# EasyEDA Pro project G-CU_2023-09-08_13-42-00.eprj, board PCB1
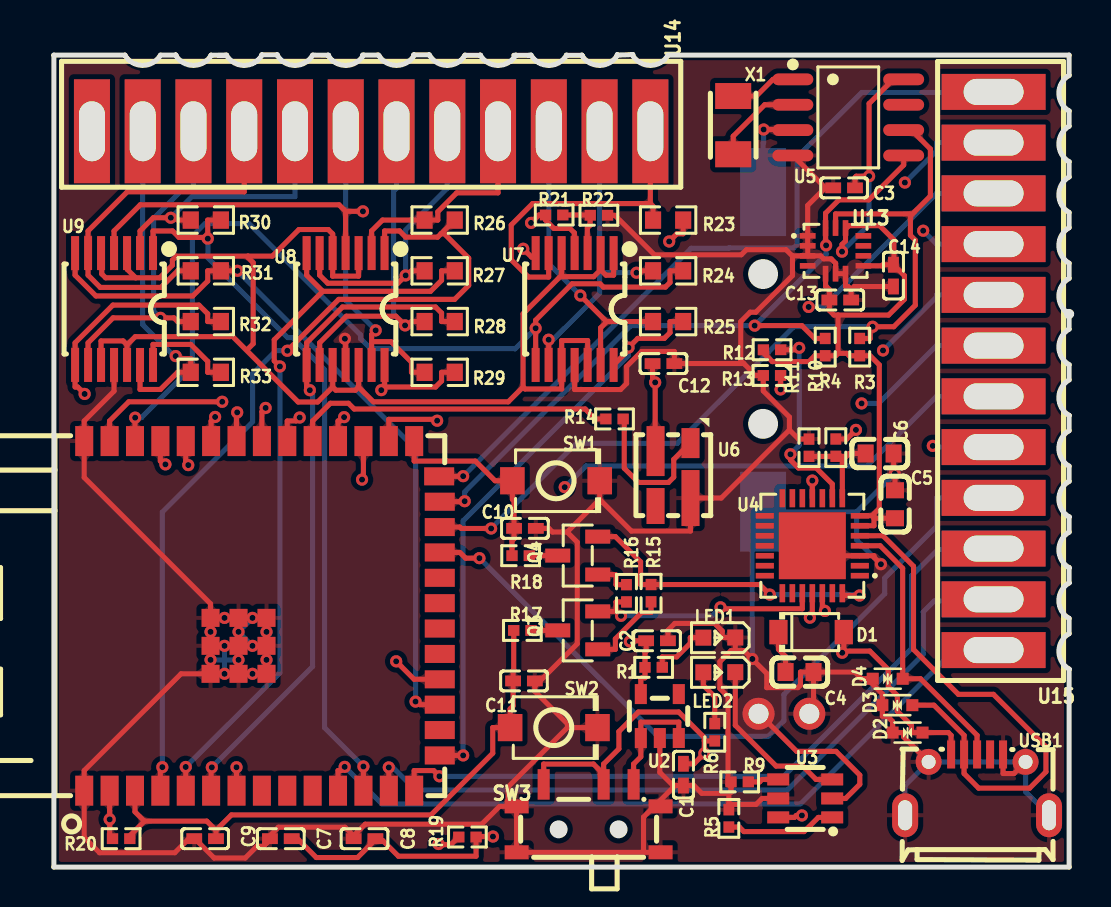
[diagram p2: board, top side]
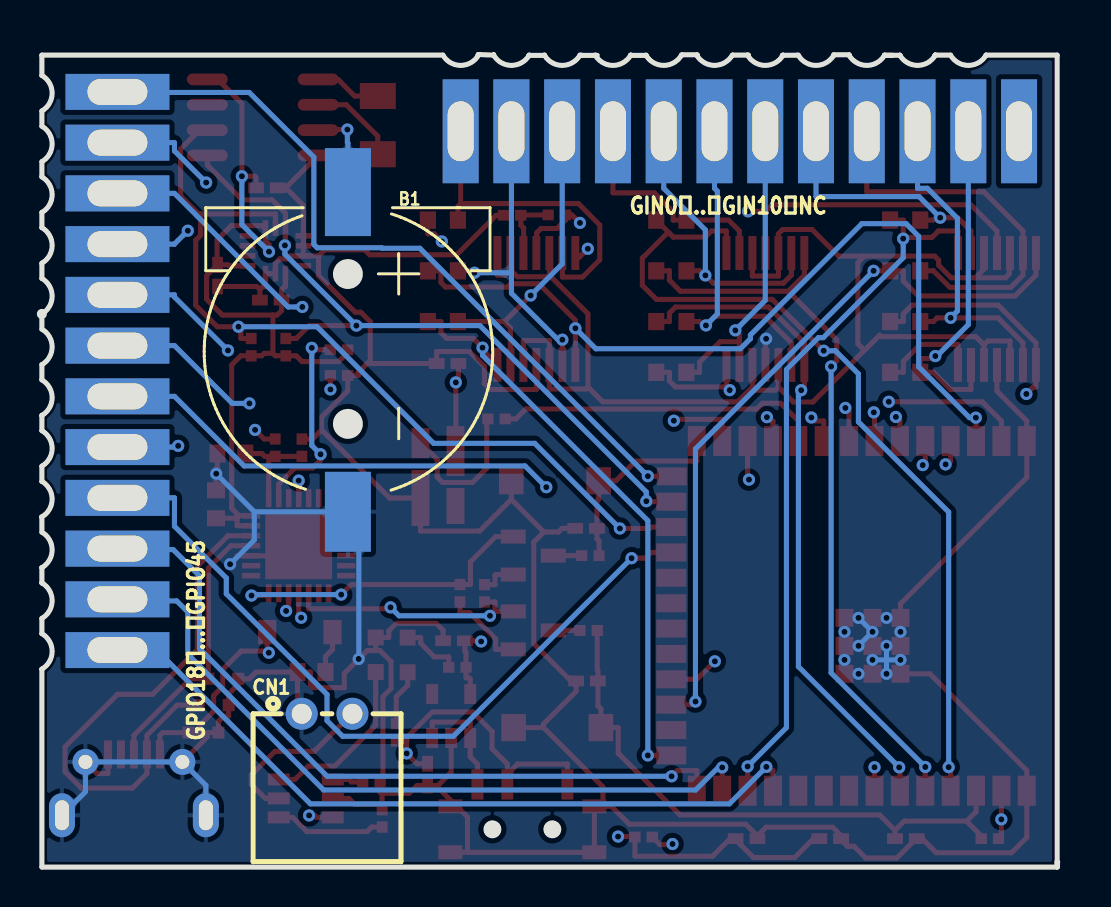
[diagram p3: board, bottom side, seen from below]

Outline 50.8 x 40.67 mm; copper layers: Top Layer, 信号层1, 信号层2, Bottom Layer. Coordinates in mm from the lower left corner of the outline.
Outline path: 3.56,40.64 0,40.64 0,0 50.8,0 50.8,9.91 arc(50.29,10.8) 50.8,11.68 50.8,12.45 arc(50.29,13.33) 50.8,14.22 50.8,14.99 arc(50.29,15.87) 50.8,16.76 50.8,17.53 arc(50.29,18.42) 50.8,19.3 50.8,20.07 arc(50.29,20.95) 50.8,21.84 50.8,22.61 arc(50.29,23.49) 50.8,24.38 50.8,25.15 arc(50.29,26.03) 50.8,26.92 50.8,27.69 arc(50.29,28.58) 50.8,29.46 50.8,30.23 arc(50.29,31.11) 50.8,32 50.8,32.77 arc(50.29,33.66) 50.8,34.54 50.8,35.31 arc(50.29,36.19) 50.8,37.08 50.8,37.85 arc(50.29,38.73) 50.8,39.62 50.8,40.64 30.73,40.64 arc(29.84,40.13) 28.96,40.64 ; 3.56,40.64 3.55,40.64 ; 3.56,40.64 arc(4.45,40.13) 5.33,40.64 6.1,40.64 6.1,40.64 6.11,40.63 ; 6.1,40.64 arc(6.1,40.64) 6.1,40.64 arc(6.98,40.13) 7.87,40.63 ; 7.86,40.63 7.87,40.63 ; 7.87,40.63 arc(7.87,40.64) 7.87,40.64 ; 7.87,40.63 8.64,40.64 arc(8.64,40.64) 8.64,40.63 ; 8.25,40.63 8.64,40.63 ; 8.64,40.63 arc(9.53,40.13) 10.41,40.64 10.4,40.66 ; 10.41,40.66 11.17,40.66 11.18,40.64 arc(12.06,40.13) 12.95,40.64 13.72,40.63 ; 13.72,40.63 arc(13.72,40.64) 13.72,40.64 ; 13.72,40.63 13.74,40.63 13.75,40.62 ; 13.72,40.63 arc(13.72,40.63) 13.73,40.62 arc(14.62,40.13) 15.49,40.64 16.21,40.64 16.22,40.64 ; 15.44,40.64 15.49,40.64 ; 18,40.66 18.03,40.64 arc(17.15,40.13) 16.26,40.64 ; 18.03,40.66 18.77,40.66 18.8,40.64 arc(19.68,40.13) 20.57,40.63 ; 20.57,40.63 21.33,40.63 21.34,40.63 ; 20.57,40.63 arc(20.57,40.64) 20.57,40.64 ; 21.34,40.63 arc(21.34,40.63) 21.34,40.64 arc(21.34,40.64) 21.34,40.64 ; 21.34,40.63 arc(22.23,40.13) 23.11,40.63 ; 23.01,40.63 23.11,40.63 ; 23.11,40.63 23.78,40.63 23.88,40.64 arc(24.76,40.13) 25.65,40.63 ; 23.11,40.63 arc(23.11,40.64) 23.11,40.64 ; 25.65,40.63 26.42,40.63 26.43,40.62 ; 25.65,40.63 arc(25.65,40.64) 25.65,40.64 ; 26.43,40.62 arc(26.42,40.63) 26.42,40.63 arc(26.42,40.64) 26.42,40.64 ; 26.43,40.62 arc(27.31,40.13) 28.19,40.64 28.96,40.67 28.96,40.67 28.97,40.66
Stack: Top Layer 0.035mm / Dielectric1 0.48mm PP er 4.5 / 信号层1 0.035mm / Dielectric2 0.48mm FR4 er 4.5 / 信号层2 0.035mm / Dielectric3 0.48mm PP er 4.5 / Bottom Layer 0.035mm

## Design rules (mm)
template: 自定义配置
spacing copperThickness1oz (default): track to track 0.102, other pairs 0.152 to 0.3
spacing copperThickness2oz: track to track 0.203, other pairs 0.152 to 0.3
spacing copperThicknessInner0.5oz: track to track 0.089, other pairs 0.152 to 0.3
track width copperThickness1oz (default): min 0.102, default 0.254, max 2.54
track width copperThickness2oz: min 0.203, default 0.254, max 2.54
track width copperThickness0.5oz: min 0.089, default 0.254, max 2.54
differential pair differentialPair (default): width min 0.127, default 0.254, max 2.54; gap min 0.152, default 0.152
via viaSize (default): diameter min 0.3, default 0.61, max 10; hole min 0.201, default 0.305, max 6.299

## Placement (name value [footprint] x y rotation side)
B1  CR1220-2  [BAT-SMD_CR1220-2]  35.49 25.78 270 bottom
C1  1uF  [c0402]  31.5 4.62 90 top
C2  1uF  [C0402]  30.18 11.33 180 top
C3  1uF  [C0402]  39.54 34 0 top
C4  10uF  [C0603]  37.31 9.76 180 top
C5  10uF  [C0603]  42.09 18.16 270 top
C6  1uF  [C0603]  41.32 20.7 180 top
C7  10uF  [C0402]  11.36 1.42 0 top
C8  100pF  [C0402]  15.54 1.42 0 top
C9  1uF  [C0402]  7.57 1.42 0 top
C10  100pF  [C0402]  23.57 16.95 180 top
C11  100pF  [C0402]  23.52 9.32 180 top
C12  100pF  [C0402]  30.5 25.2 0 top
C13  100nF  [C0402]  39.35 28.38 180 top
C14  100nF  [C0402]  42.01 29.6 90 top
CN1  XH-2AW  [CONN-TH_XH-2AW_C2908611]  36.53 7.67 180 bottom
D1  1N5819HW-7-F  [SOD-123_L2.7-W1.6-LS3.7-RD]  37.89 11.76 0 top
D2  LESD5D5.0CT1G  [SOD-523_L1.2-W0.8-LS1.6-BI]  42.72 6.73 0 top
D3  LESD5D5.0CT1G  [SOD-523_L1.2-W0.8-LS1.6-BI]  42.2 8.1 0 top
D4  LESD5D5.0CT1G  [SOD-523_L1.2-W0.8-LS1.6-BI]  41.72 9.43 0 top
LED1  NCD0603R1  [LED0603-RD_RED]  33.3 11.49 180 top
LED2  NCD0603G1  [LED0603-RD]  33.3 9.75 180 top
Q3  L8050QLT1G  [SOT-23-3_L2.9-W1.3-P1.90-LS2.4-BR]  26.21 11.85 0 top
Q4  L8050QLT1G  [SOT-23-3_L2.9-W1.3-P1.90-LS2.4-BR]  26.21 15.59 0 top
R1  5.1kΩ  [R0402]  30.01 9.99 0 top
R3  4.7kΩ  [R0402]  40.32 26.02 270 top
R4  4.7kΩ  [R0402]  38.59 26.02 270 top
R5  10kΩ  [R0402]  33.77 2.44 270 top
R6  5.1kΩ  [R0402]  33.07 6.75 270 top
R9  680Ω  [R0402]  34.32 4.26 0 top
R10  22.1kΩ  [R0402]  39.13 20.99 90 top
R11  47.5kΩ  [R0402]  37.78 20.99 270 top
R12  1kΩ  [R0402]  35.94 25.89 180 top
R13  10kΩ  [R0402]  35.93 24.61 0 top
R14  0Ω  [R0402]  28.05 22.43 180 top
R15  10kΩ  [R0402]  29.88 13.71 270 top
R16  10kΩ  [R0402]  28.65 13.7 90 top
R17  0Ω  [R0402]  23.44 11.84 180 top
R18  0Ω  [R0402]  23.36 15.58 180 top
R19  0Ω  [R0402]  20.69 1.5 180 top
R20  10kΩ  [R0402]  3.37 1.42 180 top
R21  1.8kΩ  [R0402]  25.03 32.64 180 top
R22  200Ω  [R0402]  27.27 32.63 180 top
R23  5kΩ  [R0603]  30.74 32.38 0 top
R24  5kΩ  [R0603]  30.74 29.84 0 top
R25  5kΩ  [R0603]  30.74 27.3 0 top
R26  5kΩ  [R0603]  19.31 32.38 0 top
R27  5kΩ  [R0603]  19.31 29.84 0 top
R28  5kΩ  [R0603]  19.31 27.3 0 top
R29  5kΩ  [R0603]  19.31 24.76 0 top
R30  5kΩ  [R0603]  7.6 32.38 0 top
R31  5kΩ  [R0603]  7.6 29.84 0 top
R32  5kΩ  [R0603]  7.6 27.3 0 top
R33  5kΩ  [R0603]  7.6 24.76 0 top
SW1  TS-1088-AR02016  [SW-SMD_L3.9-W3.0-P4.45]  25.13 19.34 0 top
SW2  TS-1088-AR02016  [SW-SMD_L3.9-W3.0-P4.45]  25.01 6.98 0 top
SW3  MSK12C02  [SW-TH_MSK12C02]  26.76 2.44 0 top
U1  ESP32-S3-WROOM-1-N4  [WIRELM-SMD_ESP32-S3-WROOM-1]  10.41 12.57 90 top
U2  TLV75733PDBVR  [SOT-23-5_L2.9-W1.6-P0.95-LS2.8-BL]  30.32 7.56 0 top
U3  BQ21040DBVR  [SOT-23-6_L2.9-W1.6-P0.95-LS2.8-BR]  37.59 3.43 0 top
U4  CP2102N-A02-GQFN28  [QFN-28_L5.0-W5.0-P0.50-TL-EP3.3]  37.95 16.08 180 top
U5  BQ32002D  [SOIC-8_L4.9-W3.9-P1.27-LS6.0-BL]  39.75 37.52 270 top
U6  SK6812mini  [LED-SMD_4P-L3.7-W3.5-P1.75-BR-SK6812MINI]  30.98 19.65 90 top
U7  OPA4314AIPWR  [TSSOP-14_L5.0-W4.4-P0.65-LS6.4-BL]  26.06 27.93 180 top
U8  OPA4314AIPWR  [TSSOP-14_L5.0-W4.4-P0.65-LS6.4-BL]  14.6 27.93 180 top
U9  OPA4314AIPWR  [TSSOP-14_L5.0-W4.4-P0.65-LS6.4-BL]  3.01 27.93 180 top
U13  BMX160  [LGA-14_L3.0-W2.5-P0.50-BL]  39.11 30.84 270 top
U14  -  [GCU-CON-v1]  15.88 36.83 180 top
U15  -  [GCU-CON-v1]  47.02 24.83 90 top
USB1  MicroXNJ  [MICRO-USB-SMD_MICROXNJ]  46.19 4.11 0 top
X1  32.768kHz  [CRYSTAL-SMD_L3.2-W1.5]  33.99 37.14 270 top

## Footprints (pads in the part's own frame, mm; a bottom-side part is the same pattern mirrored in y, then rotated)
BAT-SMD_CR1220-2
  rect 4.4x2.3 smd: 1(-8,0)
  rect 4x2.3 smd: 2(8,0)
c0402
  rect 0.79x0.54 smd: 1(-0.545,0) 2(0.545,0)
C0402
  rect 0.79x0.54 smd: 1(-0.545,0) 2(0.545,0)
C0603
  rect 0.8x0.9 smd: 1(-0.7,0) 2(0.7,0)
CONN-TH_XH-2AW_C2908611
  round 1.6 hole 1: 1(-1.27,0) 2(1.27,0)
CRYSTAL-SMD_L3.2-W1.5
  rect 1.3x1.8 smd: 1(-1.458,0) 2(1.458,0)
GCU-CON-v1
  rect 1.8x5.2 hole 1.3x3: 1(-13.97,0) 2(-11.43,0) 3(-8.89,0) 4(-6.35,0) 5(-3.81,0) 6(-1.27,0) 7(1.27,0) 8(3.81,0) 9(6.35,0) 10(8.89,0) 11(11.43,0) 12(13.97,0)
LED0603-RD
  rect 0.8x0.8 smd: 1(-0.799,-0.004) 2(0.799,0.004)
LED0603-RD_RED
  rect 0.8x0.8 smd: 1(-0.799,-0.004) 2(0.799,0.004)
LED-SMD_4P-L3.7-W3.5-P1.75-BR-SK6812MINI
  rect 1.5x0.9 smd: 1(1.575,-0.875)
  rect 2.5x0.9 smd: 2(1.175,0.875)
  rect 1.8x0.9 smd: 3(-1.575,0.875)
  rect 2.8x0.9 smd: 4(-1.175,-0.875)
LGA-14_L3.0-W2.5-P0.50-BL
  rect 0.28x0.785 smd: 1(-0.75,-1.393) 2(-0.25,-1.393) 3(0.25,-1.393) 4(0.75,-1.393) 8(0.75,1.393) 9(0.25,1.393) 10(-0.25,1.393) 11(-0.75,1.393)
  rect 0.785x0.28 smd: 5(1.143,-0.5) 6(1.143,0) 7(1.143,0.5) 12(-1.143,0.5) 13(-1.143,0) 14(-1.143,-0.5)
MICRO-USB-SMD_MICROXNJ
  rect 0.4x1.4 smd: 1(-1.3,1.522) 2(-0.65,1.522) 3(0,1.522) 4(0.65,1.522) 5(1.3,1.522)
  round 1.3 hole 0.7: 6(2.425,1.149) 9(-2.425,1.149)
  oval 1.3x2.2 hole 0.7x1.5: 7(3.6,-1.522) 8(-3.6,-1.522)
QFN-28_L5.0-W5.0-P0.50-TL-EP3.3
  rect 0.905x0.28 smd: 1(-2.377,1.5) 2(-2.377,1) 3(-2.377,0.5) 4(-2.377,0) 5(-2.377,-0.5) 6(-2.377,-1) 7(-2.377,-1.5) 15(2.377,-1.5) 16(2.377,-1) 17(2.377,-0.5) 18(2.377,0) 19(2.377,0.5) 20(2.377,1) 21(2.377,1.5)
  rect 0.28x0.905 smd: 8(-1.5,-2.377) 9(-1,-2.377) 10(-0.5,-2.377) 11(0,-2.377) 12(0.5,-2.377) 13(1,-2.377) 14(1.5,-2.377) 22(1.5,2.377) 23(1,2.377) 24(0.5,2.377) 25(0,2.377) 26(-0.5,2.377) 27(-1,2.377) 28(-1.5,2.377)
  rect 3.35x3.35 smd: 29(0,0)
R0402
  rect 0.566x0.54 smd: 1(-0.433,0) 2(0.433,0)
R0603
  rect 0.806x0.864 smd: 1(-0.753,0) 2(0.753,0)
SOD-123_L2.7-W1.6-LS3.7-RD
  rect 0.91x1.22 smd: 1(-1.635,0) 2(1.635,0)
SOD-523_L1.2-W0.8-LS1.6-BI
  rect 0.6x0.6 smd: 1(-0.75,0) 2(0.75,0)
SOIC-8_L4.9-W3.9-P1.27-LS6.0-BL
  oval 0.588x2.045 smd: 1(-1.905,-2.772) 2(-0.635,-2.772) 3(0.635,-2.772) 4(1.905,-2.772) 5(1.905,2.772) 6(0.635,2.772) 7(-0.635,2.772) 8(-1.905,2.772)
SOT-23-3_L2.9-W1.3-P1.90-LS2.4-BR
  rect 1.25x0.7 smd: 1(1,-0.95) 2(1,0.95) 3(-1,0)
SOT-23-5_L2.9-W1.6-P0.95-LS2.8-BL
  rect 0.6x1 smd: 1(-0.95,-1.1) 2(0,-1.1) 3(0.95,-1.1) 4(0.95,1.1) 5(-0.95,1.1)
SOT-23-6_L2.9-W1.6-P0.95-LS2.8-BR
  rect 1.1x0.6 smd: 1(1.35,-0.95) 2(1.35,0) 3(1.35,0.95) 4(-1.35,0.95) 5(-1.35,0) 6(-1.35,-0.95)
SW-SMD_L3.9-W3.0-P4.45
  rect 1.23x1.36 smd: 1(-2.185,0) 2(2.185,0)
SW-TH_MSK12C02
  rect 0.6x1.524 smd: 1(-2.25,1.7) 2(0.75,1.7) 3(2.25,1.7)
  rect 1.2x0.7 smd: 4(-3.6,0.6) 4(-3.6,-1.7) 4(3.6,0.6) 4(3.6,-1.7)
TSSOP-14_L5.0-W4.4-P0.65-LS6.4-BL
  rect 0.4x1.7 smd: 1(-1.95,-2.8) 2(-1.3,-2.8) 3(-0.65,-2.8) 4(0,-2.8) 5(0.65,-2.8) 6(1.3,-2.8) 7(1.95,-2.8) 8(1.95,2.8) 9(1.3,2.8) 10(0.65,2.8) 11(0,2.8) 12(-0.65,2.8) 13(-1.3,2.8) 14(-1.95,2.8)
WIRELM-SMD_ESP32-S3-WROOM-1
  rect 1.5x0.9 smd: 1(-8.75,8.895) 2(-8.75,7.625) 3(-8.75,6.355) 4(-8.75,5.085) 5(-8.75,3.815) 6(-8.75,2.545) 7(-8.75,1.275) 8(-8.75,0.005) 9(-8.75,-1.265) 10(-8.75,-2.535) 11(-8.75,-3.805) 12(-8.75,-5.075) 13(-8.75,-6.345) 14(-8.75,-7.615) 27(8.75,-7.615) 28(8.75,-6.345) 29(8.75,-5.075) 30(8.75,-3.805) 31(8.75,-2.535) 32(8.75,-1.265) 33(8.75,0.005) 34(8.75,1.275) 35(8.75,2.545) 36(8.75,3.815) 37(8.75,5.085) 38(8.75,6.355) 39(8.75,7.625) 40(8.75,8.895)
  rect 0.9x1.5 smd: 15(-6.985,-8.895) 16(-5.715,-8.895) 17(-4.445,-8.895) 18(-3.175,-8.895) 19(-1.905,-8.895) 20(-0.635,-8.895) 21(0.635,-8.895) 22(1.905,-8.895) 23(3.175,-8.895) 24(4.445,-8.895) 25(5.715,-8.895) 26(6.985,-8.865)
  rect 0.9x0.9 smd: 41(-2.9,2.575) 41(-2.9,1.175) 41(-2.9,-0.225) 41(-1.5,2.575) 41(-1.5,1.175) 41(-1.5,-0.225) 41(-0.1,2.575) 41(-0.1,1.175) 41(-0.1,-0.225)

## Nets
As in the schematic.

Pads without a net: U1 8 9 10 16 19 20 21 22; U2 4; U4 1 2 10 12 13 14 15 16 17 18 19 20 21 22 23 27; U5 7; U6 3; U13 4 9 10 11; U14 12; USB1 4

## Via types
v1: diameter 0.61, hole 0.305, Top Layer to Bottom Layer, 96 vias

## Routing (per net, layer and track width the routed paths; a pad name or vN(x,y) marks a point on that pad's centre or on a via; arc(x,y) is an arc through that point)
GND: length 257.7
  Top Layer w0.254: 7.84,11.07 v1(8.54,11.07) v1(9.94,11.07) 10.64,11.07 ; 23.16,3.04 23.16,0.82 23.12,0.79 ; 23.16,3.04 23.16,3.04 ; 23.16,3.04 22.73,3.04 ; 33.77,3.69 33.77,3.14 ; 33.77,3.69 33.82,3.74 33.88,3.74 33.88,4 ; 33.77,3.69 32.42,3.69 32.03,4.08 C1.1 30.98,4.08 ; 33.77,3.14 33.77,2.87 ; 33.77,3.14 35.14,3.14 35.44,3.43 36.24,3.43 ; R11.1 37.26,21.42 36.8,21.88 ; D4.1 40.7,9.43 ; 40.7,9.43 41.46,8.67 D3.1 41.46,7.55 41.7,7.55 41.97,7.29 D2.1 42.52,6.73 42.52,6.51 USB1.9 ; 40.7,9.43 40.42,9.43 40.08,9.76 C4.1 ; 25.7,6.98 27.2,6.98 ; 25.7,6.98 25.7,7.17 24.07,8.79 24.07,9.05 ; 25.7,6.98 22.73,4.01 22.73,3.04 ; v1(41.38,15.16) 41.04,15.5 41.04,15.58 38.45,15.58 37.95,16.08 ; 36.96,30.58 36.96,29.61 35.12,27.77 34.84,27.77 34.37,27.3 34.37,25.36 34.52,25.2 ; 36.96,30.58 36.64,30.9 34.65,30.9 34.4,30.65 30.05,30.65 28.07,32.62 27.72,32.62 ; 36.96,30.58 36.97,30.56 ; 36.96,30.58 36.96,30.59 37.72,30.59 ; 30.98,4.08 30.32,4.74 30.32,6.46 ; 30.98,4.08 30.98,3.98 30.04,3.04 ; 29.5,0.74 29.5,2.5 30.04,3.04 ; 29.5,0.74 30.36,0.74 ; 29.5,0.74 23.16,0.74 ; 34.52,25.2 C12.2 31.05,25.81 29.41,25.81 28.66,25.06 28.66,24.2 28.36,23.9 26.06,23.9 U7.11 ; 34.52,25.2 34.96,24.77 34.96,24.61 R13.1 35.5,23.83 36.8,22.53 36.8,21.88 ; 38.6,34 36.98,35.62 ; 38.6,34 39,34 ; 38.6,34 37.72,33.12 37.72,31.09 ; 36.8,21.88 33.4,18.47 31.86,18.47 31.86,16.82 28.9,16.82 27.31,18.4 ; v1(10.64,10.37) 10.64,9.67 v1(9.94,9.67) v1(8.54,9.67) 6.37,9.67 1.52,4.83 U1.1 1.52,1.48 2.29,0.72 6.05,0.72 6.71,1.38 7.1,1.38 8.02,0.45 9.58,0.45 10.16,1.04 10.49,1.04 ; 25.68,16.77 26.19,16.26 26.19,11.17 24.07,9.05 ; 25.68,16.77 24.95,16.77 24.77,16.95 24.12,16.95 ; 25.68,16.77 27.31,18.4 ; 30.04,3.04 SW3.4 ; 10.8,1.36 10.49,1.04 ; 10.8,1.35 10.49,1.04 ; 10.8,1.36 10.8,1.43 ; 10.8,1.36 10.8,1.56 11.23,1.99 14.57,1.99 15,1.56 15.58,2.14 21.41,2.14 22.3,3.04 22.73,3.04 ; 39.12,29.7 39.12,30.22 38.9,30.44 38.52,30.44 38.37,30.59 U13.3 U13.2 ; 39.12,29.7 39.12,29.67 ; 39.12,29.7 39.61,29.7 39.61,29.05 39.75,29.05 39.89,28.91 ; 34.1,10.84 33.88,10.84 33.33,10.28 33.33,8.94 33.73,8.53 33.73,4.15 33.88,4 ; 34.1,10.84 34.52,10.84 35.67,9.69 35.67,8.98 37.23,8.98 37.36,9.11 37.36,9.76 C4.1 ; 34.1,10.84 LED1.1 33.44,11.49 33.44,11.82 33.06,12.19 31.07,12.19 30.73,11.85 30.73,11.33 ; 27.31,18.4 27.31,19.34 ; C11.1 24.07,9.05 ; 37.94,8 38.01,8.07 C4.1 ; 33.88,4 R9.1 ; 39.89,28.91 C13.1 ; 39.89,28.91 40.05,29.06 42.01,29.06 ; USB1.5 47.5,4.68 48.04,4.68 USB1.6 ; v1(10.64,11.77) 10.64,12.47 v1(9.94,12.47) v1(8.54,12.47) 7.84,12.47 7.84,13.18 1.52,19.5 U1.40 1.52,22.33 3.01,23.82 U9.11 ; 42.02,20.7 42.02,20 42.08,19.94 v1(42.08,19.69) 42.09,19.68 C5.1 ; 14.6,25.13 14.6,26.41 v1(14.56,26.44)
  信号层1 w0.254: v1(7.84,11.77) v1(8.54,12.47)
  信号层2 w0.254: v1(14.56,26.44) 14.35,26.24 14.35,23.36 9.94,18.95 v1(9.94,12.47)
  Bottom Layer w0.254: 34.83,16.02 34.94,15.91 34.94,10.25 ; 9.94,11.07 v1(9.24,11.77) v1(9.94,12.47) ; 49.79,2.59 48.62,3.77 USB1.6 USB1.9 42.6,4.09 42.6,2.59 ; v1(8.54,9.67) 8.54,10.37 ; 8.54,10.37 v1(8.54,11.07) ; 8.54,10.37 v1(9.24,10.37) ; 8.54,10.37 v1(7.84,10.37) ; 40.17,17.78 40.17,16.37 v1(41.38,15.16) ; 40.17,17.78 B1.2 ; 40.17,17.78 v1(42.08,19.69)
  vias: v1(34.95,10.42)
VBAT: length 27
  Top Layer w0.254: 33.07,6.31 32.55,6.31 v1(32.55,5.69) 32.03,5.17 C1.2 ; 27.51,4.65 27,5.16 24.51,5.16 24.51,4.14 ; 27.51,4.65 27.51,4.14 ; 27.51,4.65 27.51,5.16 28.27,5.92 28.27,6.78 29.25,7.76 31.27,7.76 32.55,6.48 32.55,6.31 ; 35.27,7.69 37.17,5.79 39.14,5.79 40.33,4.6 40.33,4.14 39.62,3.43 38.98,3.43
  信号层2 w0.254: 35.31,7.66 33.34,5.69 v1(32.55,5.69)
VBUS: length 33.2
  Top Layer w0.254: R10.2 39.68,21.42 v1(40.13,21.88) ; v1(37.43,2.58) 37.15,2.58 37.05,2.48 36.24,2.48 ; 39.53,10.81 D1.2 ; 39.53,10.81 39.45,10.73 ; 39.53,10.81 40.83,10.81 41.75,9.89 41.75,9.04 42.2,8.58 42.2,7.8 42.91,7.09 42.91,6.73 44.76,6.73 44.89,6.59 USB1.1
  信号层2 w0.254: v1(40.13,21.88) 39.4,21.14 39.4,10.78 v1(39.45,10.73) 39.45,4.6 v1(37.43,2.58)
VCC_3V3: length 145.9
  Top Layer w0.254: v1(39.44,30.8) 39.44,31.16 39.61,31.34 39.61,31.99 ; 41.04,17.46 C5.2 ; 41.04,17.46 41.04,17.58 40.93,17.58 ; 41.04,17.46 41.04,17.08 40.33,17.08 ; 14.6,32.82 v1(15.47,32.82) ; 14.6,32.82 14.6,30.73 ; 14.6,32.82 14.27,33.15 4.32,33.15 3.01,31.84 3.01,30.73 ; 39.24,25.71 39.68,25.71 39.8,25.59 40.85,25.59 41.3,25.14 41.3,17.95 40.93,17.58 ; 39.24,25.71 39.12,25.59 38.07,25.59 37.78,25.3 35.95,25.3 35.5,25.75 35.5,25.89 ; 39.24,25.71 39.24,27.63 ; 40.09,34 40.09,34.52 40.14,34.58 v1(40.79,34.58) 40.79,38.22 42,39.43 42.52,39.43 ; 40.93,17.58 40.33,17.58 ; 38.61,29.7 38.61,29.05 38.66,29.05 38.8,28.91 C13.2 38.8,27.86 39.03,27.63 39.24,27.63 ; C12.1 29.96,24.39 v1(30.09,24.26) 30.09,20.84 30.11,20.82 ; 39.63,31.95 39.79,32.1 41.32,32.1 42.03,31.39 42.03,30.21 ; 11.79,1.39 11.8,1.37 12.24,1.37 13.13,0.48 15.2,0.48 16.04,1.32 16.46,1.32 17.24,0.54 21.12,0.54 21.12,1.53 v1(21.97,1.53) ; 29.37,8.66 29.37,9.42 29.43,9.47 29.58,9.47 29.58,10.75 29.64,10.8 29.64,11.33 28.99,11.33 28.95,11.29 v1(28.82,11.29) ; 39.24,27.63 41.77,27.63 42.56,28.42 42.56,29.6 C14.2 41.49,30.15 41.43,30.09 U13.8 ; 26.05,30.73 26.04,30.74 26.04,31.74 25.82,31.96 25.02,31.96 24.6,32.38 R21.2 24.27,32.64 v1(23.88,32.24)
  信号层1 w0.254: v1(21.97,1.53) 21.97,4.44 v1(28.82,11.29)
  信号层2 w0.254: v1(23.88,32.24) 22.57,30.94 ; 22.57,30.94 22.47,31.04 17.25,31.04 v1(15.47,32.82) ; 22.57,30.94 28.39,25.12 29.56,25.12 ; 29.56,25.12 30.09,24.59 v1(30.09,24.26) 30.09,12.56 v1(28.82,11.29) ; 29.56,25.12 29.56,25.29 35.99,31.71 39.4,31.71 39.44,31.67 v1(39.44,30.8)
  Bottom Layer w0.254: v1(40.79,34.58) 40.79,32.16 v1(39.44,30.8)
VCC_5V: length 2.1
  Top Layer w0.254: C4.2 36.61,10.54 36.26,10.9 D1.1
CHIP_PU: length 29.7
  Top Layer w0.254: 8.1,1.37 8.11,1.39 C9.2 8.11,1.84 ; 3.79,1.38 3.8,1.38 3.8,1.56 4.53,2.29 ; 23.01,11.84 23.01,9.87 22.98,9.84 C11.2 22.98,8.07 22.83,7.92 22.83,6.98 21.96,6.98 21.96,5.7 18.87,2.61 8.88,2.61 8.11,1.84 ; 4.53,2.29 4.54,2.3 7.65,2.3 8.11,1.84 ; 4.53,2.29 4.06,2.77 U1.3
DTR: length 15.9
  Top Layer w0.254: U4.28 39.56,13.59 v1(40.31,13.59) ; Q4.2 28.09,16.54 29.36,15.28 29.36,14.14 35.32,14.14 v1(35.82,13.64)
  Bottom Layer w0.254: v1(35.82,13.64) 40.27,13.64 v1(40.31,13.59)
ESP_3V3: length 20.6
  Top Layer w0.254: U1.2 2.79,2.82 2.79,2.81 v1(2.79,2.39) 2.79,1.59 2.94,1.44 ; v1(19.25,1.15) 19.28,1.12 19.87,1.12 20.25,1.5
  信号层1 w0.254: v1(2.79,2.39) 4.03,1.15 v1(19.25,1.15)
GIN0: length 17.1
  Top Layer w0.254: 24.76,30.73 24.76,29.53 23.75,29.53 22.89,30.39 22.89,32.14 23.96,33.21 29.84,33.21 ; 29.98,32.38 29.98,33.07 29.84,33.21 ; 29.84,33.21 29.84,36.83
GIN1: length 15.6
  Top Layer w0.254: v1(24.76,26.4) U7.9 ; v1(29.15,29.75) 29.22,29.75 29.32,29.84 29.98,29.84
  Bottom Layer w0.254: 27.31,29.75 27.31,28.72 24.98,26.4 v1(24.76,26.4) ; 27.31,29.75 27.31,36.83 ; 27.31,29.75 v1(29.15,29.75)
GIN2: length 15.4
  Top Layer w0.254: 27.67,27.3 27.67,27.3 29.98,27.3 ; 27.67,27.3 27.36,26.99 U7.13 ; 27.67,27.3 27.65,27.3 v1(26.34,28.61)
  Bottom Layer w0.254: v1(26.34,28.61) 24.77,30.19 24.77,36.83
GIN3: length 11.6
  Top Layer w0.254: 15.9,30.73 15.9,31.84 16.45,32.38 19.21,32.38 19.21,32.8 20.16,33.75 22.22,33.75 22.22,36.83
GIN4: length 14.9
  Top Layer w0.254: 18.55,29.84 17.89,29.84 17.66,29.61 v1(17.6,29.61) 17.21,29.22 13.7,29.22 13.3,29.63 13.3,30.73
  Bottom Layer w0.254: v1(17.6,29.61) 17.6,31.89 19.69,33.97 19.69,36.83
GIN5: length 17.2
  Top Layer w0.254: U8.9 13.3,26.24 14.63,27.57 17.11,27.57 v1(17.57,27.11) 17.7,27.11 17.89,27.3 18.55,27.3
  Bottom Layer w0.254: 17.15,36.83 17.15,33.97 17,33.83 17,27.68 v1(17.57,27.11)
GIN6: length 16
  Top Layer w0.254: 15.9,26.24 15.9,26.66 v1(16.1,26.86) ; 15.9,26.24 15.95,26.3 16.87,26.3 17.89,25.27 17.89,24.77 18.55,24.77 ; 15.9,26.24 15.9,25.13
  Bottom Layer w0.254: 14.61,36.83 14.61,28.36 v1(16.1,26.86)
GIN7: length 13.9
  Top Layer w0.254: 4.31,30.73 4.31,31.84 4.98,32.5 v1(5.85,32.5) 6.08,32.5 6.19,32.38 6.85,32.38
  Bottom Layer w0.254: 12.06,36.83 12.06,33.56 6.91,33.56 v1(5.85,32.5)
GIN8: length 19.6
  Top Layer w0.254: 6.85,29.84 6.19,29.84 5.36,29.02 2.32,29.02 1.71,29.63 1.71,31.84 3.67,33.8 9.53,33.8 9.53,36.83
GIN9: length 17.4
  Top Layer w0.254: 6.85,27.3 6.19,27.3 6.01,27.49 v1(5.33,27.49) 2.96,27.49 1.71,26.24 U9.9
  Bottom Layer w0.254: 6.98,36.83 6.98,33.97 6.49,33.97 4.99,32.47 4.99,27.83 v1(5.33,27.49)
GIN10: length 17.6
  Top Layer w0.254: U9.13 4.31,23.91 5.33,23.91 6.19,24.77 6.85,24.77 6.85,25.45 6.22,25.45 v1(6.1,25.58)
  Bottom Layer w0.254: 4.45,36.83 4.45,27.15 6.02,25.58 v1(6.1,25.58)
GPIO0: length 10.2
  Top Layer w0.254: U1.27 18.03,20.32 21.09,20.32 22.08,19.34 22.94,19.34 22.94,18.4 23.03,18.32 23.03,16.43 22.92,16.33 R18.2
GPIO1: length 35.3
  Top Layer w0.254: v1(8.43,23.29) 3.75,23.29 2.79,22.33 U1.39 ; 24.11,30.73 24.11,30.53 23.9,30.53 v1(23.49,30.95) ; 31.49,32.38 31.49,31.7 31.17,31.7 v1(30.79,31.31)
  信号层1 w0.254: v1(23.49,30.95) 15.94,30.95 8.43,23.43 v1(8.43,23.29)
  信号层2 w0.254: v1(23.49,30.95) 30.42,30.95 v1(30.79,31.31)
GPIO2: length 43.3
  Top Layer w0.254: v1(4.07,22.49) 4.07,22.34 4.06,22.33 U1.38 ; U7.8 v1(24.11,26.97) 24.11,27.37 25.93,29.19 27.33,29.19 27.5,29.03 30.6,29.03 30.83,29.26 30.83,29.84 31.49,29.84
  Bottom Layer w0.254: v1(24.11,26.97) 23.08,25.94 15.85,25.94 15.35,26.44 15.35,26.63 9.78,32.2 7.56,32.2 6.93,31.57 6.93,25.04 4.38,22.49 v1(4.07,22.49)
GPIO3: length 29.8
  Top Layer w0.254: 28.01,25.13 28.75,25.88 v1(28.75,26) 29.22,26.46 30.55,26.46 30.83,26.75 30.83,27.3 31.49,27.3 ; v1(20.48,5.59) U1.15
  Bottom Layer w0.254: v1(20.48,5.59) 20.48,17.34 28.75,25.61 v1(28.75,26)
GPIO4: length 43.8
  Top Layer w0.254: 16.55,30.73 16.55,31.84 17.3,31.84 17.6,31.53 19.2,31.53 19.37,31.7 ; 19.37,31.7 20.06,32.38 ; 19.37,31.7 19.54,31.7 20.76,30.48 20.76,29.12 20.05,28.41 14.25,28.41 v1(11.68,25.84) ; U1.4 5.33,4.9 v1(5.43,5)
  Bottom Layer w0.254: v1(11.68,25.84) 11.1,25.84 9.94,24.69 9.94,22.28 5.43,17.77 v1(5.43,5)
GPIO5: length 37.6
  Top Layer w0.254: v1(11.31,25.06) 11.03,25.34 11.03,26.39 13.45,28.82 ; 20.06,29.84 19.4,29.84 19.4,29.37 18.85,28.82 13.45,28.82 ; 13.45,28.82 12.65,29.63 12.65,30.73 ; v1(6.6,5.01) U1.5
  Bottom Layer w0.254: v1(11.31,25.06) 11.31,9.72 v1(6.6,5.01)
GPIO6: length 33.3
  Top Layer w0.254: v1(7.9,4.99) 7.87,4.96 U1.6 ; 20.06,27.3 19.4,27.3 19.4,27.73 19.1,28.03 14.44,28.03 12.65,26.24 U8.8 12.65,24.03 ; v1(12.81,23.87) 12.65,24.03
  Bottom Layer w0.254: v1(7.9,4.99) 12.95,10.03 12.95,23.73 v1(12.81,23.87)
GPIO7: length 28.5
  Top Layer w0.254: v1(16.38,23.87) 16.54,24.03 16.55,24.03 ; v1(9.14,5) U1.7 ; 20.06,24.77 19.4,24.77 19.4,24.33 19.1,24.03 16.55,24.03 ; 16.55,24.03 U8.14
  信号层2 w0.254: v1(9.14,5) 16.38,12.24 v1(16.38,23.87)
GPIO8: length 36.6
  Top Layer w0.254: v1(7.7,31.45) 7.7,31.58 7.65,31.63 ; v1(15.49,5.03) U1.12 ; 7.65,31.63 7.54,31.52 6.26,31.52 5.94,31.84 4.96,31.84 4.96,30.73 ; 7.65,31.63 7.7,31.68 7.7,32.38 8.36,32.38
  Bottom Layer w0.254: v1(7.7,31.45) 7.7,30.5 11.7,26.5 11.95,26.5 13.55,24.9 13.55,6.98 v1(15.49,5.03)
GPIO9: length 37
  Top Layer w0.254: v1(9.18,29.84) 7.7,29.84 7.7,29.33 6.95,28.59 2.11,28.59 1.06,29.63 1.06,30.73 ; v1(18.1,8.28) 18.15,8.28 18.31,8.13 U1.17
  Bottom Layer w0.254: v1(18.1,8.28) 18.1,20.93 v1(9.18,29.84)
GPIO10: length 35.4
  Top Layer w0.254: 8.36,27.3 7.7,27.3 7.7,27.69 7.26,28.13 2.95,28.13 1.06,26.24 1.06,24.03 1.19,24.03 v1(1.54,23.68) ; v1(17.13,10.3) 18.03,9.4 19.31,9.4
  信号层1 w0.254: v1(1.54,23.68) 1.54,23.25 14.5,10.3 v1(17.13,10.3)
GPIO11: length 5.3
  Top Layer w0.254: U9.14 4.96,26.16 6.85,26.16 7.7,25.31 7.7,24.77 8.36,24.77
GPIO18: length 37.8
  Top Layer w0.254: v1(14.55,5.01) 14.37,4.83 14.22,4.83 14.22,3.82
  Bottom Layer w0.254: 47.02,10.86 45.06,10.86 37.36,3.16 16.4,3.16 v1(14.55,5.01)
GPIO19: length 37
  Top Layer w0.254: v1(16.76,4.99) 16.76,3.82
  Bottom Layer w0.254: v1(16.76,4.99) 16.96,4.99 18.09,3.86 36.7,3.86 43.5,10.65 43.5,12.77 44.05,13.32 46.97,13.32
GPIO20: length 36.9
  Top Layer w0.254: v1(19.29,4.54) 19.01,4.83 18.03,4.83 U1.14
  Bottom Layer w0.254: 46.96,15.89 44.23,15.89 42.91,14.58 42.91,10.93 36.52,4.54 v1(19.29,4.54)
GPIO21: length 38.5
  Top Layer w0.254: U1.23 20.31,15.75 20.6,15.46 v1(21.29,15.46)
  Bottom Layer w0.254: v1(21.29,15.46) 30.21,6.55 35.75,6.55 36.53,7.32 36.53,8.64 41.57,13.68 41.57,14.47 44.17,17.06 44.17,18.48 U15.4
GPIO35: length 32.3
  Top Layer w0.254: v1(19.18,22.34) 19.11,22.41 16.76,22.41 16.76,21.32
  信号层1 w0.254: v1(43.98,21.08) 43.95,21.11 37.28,21.11 36.97,21.42 36.72,21.42 36.29,21 34.51,21 33.16,22.34 v1(19.18,22.34)
  Bottom Layer w0.254: 47.02,21.02 44.17,21.02 44.1,21.08 v1(43.98,21.08)
GPIO36: length 35.7
  Top Layer w0.254: v1(15.42,19.39) 15.49,19.46 U1.29
  信号层1 w0.254: v1(15.42,19.39) 15.87,18.94 25.49,18.94 v1(25.56,19.01)
  Bottom Layer w0.254: v1(25.56,19.01) 26.62,20.08 40.68,20.08 44.17,23.56 47.02,23.56
GPIO37: length 35.4
  Top Layer w0.254: 14.22,21.32 14.22,22.33 14.33,22.33 v1(14.52,22.52)
  信号层1 w0.254: v1(14.52,22.52) 15.29,23.29 40.34,23.29 v1(40.41,23.21)
  Bottom Layer w0.254: 47.02,26.1 44.17,26.1 41.27,23.21 v1(40.41,23.21)
GPIO38: length 16.4
  Top Layer w0.254: U1.31 12.95,22.33 13.84,23.21 14.74,23.21 15.03,22.93 26.59,22.93 27.08,22.43 27.62,22.43
GPIO39: length 39
  Top Layer w0.254: U1.32 11.68,22.33 12.13,22.33 v1(12.3,22.5)
  信号层1 w0.254: v1(41.49,25.86) 40.66,25.03 14.83,25.03 v1(12.3,22.5)
  Bottom Layer w0.254: v1(41.49,25.86) 44.17,28.54 44.17,28.64 47.02,28.64
GPIO40: length 42.5
  Top Layer w0.254: U1.33 10.41,22.79 v1(10.6,22.98)
  信号层1 w0.254: v1(43.5,31.85) 43.31,32.04 30.61,32.04 26.47,27.9 15.13,27.9 10.6,23.37 v1(10.6,22.98)
  Bottom Layer w0.254: v1(43.5,31.85) 44.17,31.19 44.17,31.18 47.02,31.18
GPIO41: length 44.7
  Top Layer w0.254: v1(9.17,22.76) 9.14,22.72 U1.34
  信号层1 w0.254: v1(9.17,22.76) 9.75,22.19 10.7,22.19 11.9,23.39 11.9,24.03 13.26,25.39 25.12,25.39 27.77,28.04 v1(37.77,28.04)
  Bottom Layer w0.254: 47.02,33.72 44.17,33.72 38.48,28.04 v1(37.77,28.04)
GPIO42: length 47.5
  Top Layer w0.254: U1.35 7.87,22.33 v1(8.07,22.53)
  信号层1 w0.254: v1(8.07,22.53) 7.67,22.93 7.67,23.78 17.34,33.45 41.77,33.45 v1(42.58,34.26)
  Bottom Layer w0.254: v1(42.58,34.26) 44.17,35.85 44.17,36.26 U15.11
GPIO45: length 38.3
  Top Layer w0.254: v1(20.48,19.57) 20.29,19.57 20.29,19.56 19.28,19.56
  Bottom Layer w0.254: v1(20.48,19.57) 31.89,30.97 33.77,30.97 33.79,31 37.02,31 37.19,31.17 37.19,35.54 40.43,38.77 47.06,38.77
RTS: length 12.3
  Top Layer w0.254: 28.13,12.83 v1(28.38,12.58) ; 28.13,12.83 28.09,12.8 27.21,12.8 ; 28.13,12.83 28.13,13.27 R16.1 ; 37.45,13.71 37.45,12.93 33.43,12.93 v1(33.36,13)
  Bottom Layer w0.254: v1(33.36,13) 32.93,12.58 v1(28.38,12.58)
SCL: length 44.2
  Top Layer w0.254: 19.31,17.02 20.31,17.02 20.39,16.95 v1(21.88,16.95) ; 40.32,26.46 40.85,26.46 40.85,26.93 v1(40.96,27.04) 42.02,27.04 43.1,28.12 43.1,31.38 42.86,31.62 42.86,32.66 ; 42.52,36.89 42.91,36.89 43.86,35.94 43.86,33.59 42.9,32.64 42.85,32.69 39.11,32.69 U13.13
  Bottom Layer w0.254: v1(21.88,16.95) 26.14,21.21 31.2,21.21 37.03,27.04 v1(40.96,27.04)
SDA: length 36
  Top Layer w0.254: 42.52,35.62 42.52,35.14 40.78,33.4 39.28,33.4 38.61,32.73 U13.14 38.61,31.14 v1(38.64,31.12) ; 38.6,26.46 38.07,26.46 37.43,27.1 v1(35.06,27.1) ; U1.25 20.31,18.29 20.34,18.31 v1(20.56,18.31)
  Bottom Layer w0.254: v1(38.64,31.12) 38.64,30.68 v1(35.06,27.1) 28.88,27.1 20.56,18.77 v1(20.56,18.31)
U0RXD: length 37.2
  Top Layer w0.254: v1(38.58,12.82) 38.58,12.87 38.45,13 U4.26 ; v1(6.73,20.12) 6.73,20.19 6.6,20.32 U1.36
  信号层1 w0.254: v1(6.73,20.12) 6.82,20.21 31.19,20.21 v1(38.58,12.82)
U0TXD: length 38
  Top Layer w0.254: U1.37 5.33,20.32 5.42,20.32 v1(5.58,20.16) ; v1(37.83,12.48) 37.95,12.6 37.95,13.71
  信号层1 w0.254: v1(5.58,20.16) 11.35,14.39 35.92,14.39 v1(37.83,12.48)
USB_D+: length 14
  Top Layer w0.254: 40.33,16.08 41.34,16.08 42.47,14.95 42.47,9.43 43.36,9.43 46.19,6.59 USB1.3
USB_D-: length 27.2
  Top Layer w0.254: 42.95,8.1 44.04,8.1 45.54,6.59 USB1.2 45.54,4.68 46.27,3.95 48.83,3.95 49.64,4.77 49.64,6.02 47.01,8.65 45.26,8.65 43.02,10.89 43.02,15.05 41.49,16.58 40.33,16.58
VOUT1: length 72.2
  Top Layer w0.254: 3.67,30.71 3.67,29.91 4.09,29.5 ; 15.25,25.13 15.25,24.03 ; 15.25,24.03 15.09,23.87 14.11,23.87 13.95,24.03 ; 15.25,24.03 15.99,23.29 22.74,23.29 23.48,24.03 ; 27.36,29.89 27.01,29.55 25.49,29.55 25.41,29.63 ; 27.36,29.89 27.36,30.73 ; 27.36,29.89 27.62,29.63 28.01,29.63 28.01,30.73 ; 15.25,30.73 15.25,29.58 13.95,29.58 13.95,30.73 ; U8.10 13.95,24.03 ; 13.95,24.03 13.2,23.28 12.22,23.28 8.88,26.62 8.81,26.55 4.07,26.55 3.66,26.14 ; 4.09,29.5 5.3,29.5 5.93,30.13 5.93,30.38 6.13,30.58 9.72,30.58 ; 4.09,29.5 2.59,29.5 2.4,29.69 2.4,30.67 ; 13.95,30.73 13.95,31.69 13.73,31.91 12.26,31.91 10.93,30.58 9.72,30.58 ; 3.66,26.14 3.47,26.33 2.36,26.33 2.36,25.13 ; 3.66,26.14 U9.12 ; 9.66,25.88 9.97,26.19 9.97,30.25 9.72,30.5 9.72,30.58 ; 26.71,25.13 26.71,26.35 25.41,26.35 U7.10 25.41,23.93 23.58,23.93 23.48,24.03 ; 23.48,24.03 23.48,27.69 25.41,29.63 ; 25.41,30.73 25.41,29.63
$1N2540: length 3.1
  Top Layer w0.254: 30.44,9.99 30.44,10.52 31.16,10.52 31.84,11.2 31.84,11.48 LED1.2
$1N2933: length 3.3
  Top Layer w0.254: X1.1 35.15,38.59 35.98,39.43 36.98,39.43
$1N2943: length 4.5
  Top Layer w0.254: X1.2 33.99,36.58 35.57,38.16 36.98,38.16
$1N2977: length 4.6
  Top Layer w0.254: v1(35.51,36.92) 36.95,36.92 36.98,36.89
  Bottom Layer w0.254: v1(35.51,36.92) 35.51,36.26 35.49,36.24 B1.1
$1N5698: length 5.6
  Top Layer w0.254: 38.94,2.48 38.25,2.48 37.54,1.77 34.53,1.77 34.3,2 33.77,2
$1N5744: length 2.8
  Top Layer w0.254: 33.07,7.18 33.07,8.52 32.5,9.1 32.5,9.75
$1N5776: length 8.6
  Top Layer w0.254: LED2.1 34.1,7.09 36.14,5.05 37.47,5.05 38.14,4.38 38.94,4.38
$1N6032: length 1.5
  Top Layer w0.254: R9.2 35.32,4.26 35.44,4.38 36.24,4.38
$1N7305: length 5.3
  Top Layer w0.254: 40.62,20.7 39.79,20.7 39.65,20.56 R10.1 ; R11.2 39.4,20.56 39.45,20.5 U4.8
$1N7502: length 10.1
  Top Layer w0.254: U4.9 38.95,19.17 38.15,19.97 37.26,19.97 36.86,20.38 v1(36.86,20.66) ; v1(37.29,25.99) 37.2,25.89 R12.1
  Bottom Layer w0.254: v1(37.29,25.99) 37.29,21.1 v1(36.86,20.66)
$1N7540: length 6.8
  Top Layer w0.254: 37.95,18.46 v1(37.95,19.34) ; R13.2 v1(36.36,23.91)
  信号层2 w0.254: v1(37.95,19.34) 37.95,22.32 v1(36.36,23.91)
$1N7794: length 7.3
  Top Layer w0.254: 31.86,21.25 31.02,20.4 31.02,19.52 30.75,19.25 29.25,19.25 28.54,19.96 28.54,22.33
$1N8190: length 1.3
  Top Layer w0.254: Q3.3 24.33,11.85 24.33,11.84 R17.1
$1N8194: length 1.4
  Top Layer w0.254: Q4.3 24.33,15.59 24.33,15.59 R18.1
$1N8229: length 4.3
  Top Layer w0.254: 29.88,13.28 29.88,12.74 29.41,12.74 28.09,11.42 28.09,10.9 27.21,10.9
$1N8232: length 1.9
  Top Layer w0.254: R16.2 28.13,14.13 28.13,14.61 28.09,14.64 Q4.1
$1N11489: length 3.3
  Top Layer w0.254: 26.68,30.75 26.69,30.77 26.69,31.99 26.83,32.13 26.83,32.58 26.77,32.64 25.48,32.64
$1N12314: length 6
  Top Layer w0.254: 31.27,6.46 31.27,7.25 29.37,7.25 29.37,5.52 29.01,5.16 29.01,4.14

## Copper pours and planes (outline as drawn; the poured copper is in the pictures)
GND on Top Layer: 0.05,40.41 50.85,40.41 50.85,0.05 0.05,0.05
GND on Bottom Layer: 0.1,40.61 50.85,40.61 50.85,0.13 0.1,0.13
GND on 信号层1: 0.03,40.63 50.8,40.63 50.8,0.01 0.03,0.01
GND on 信号层2: 0.06,40.62 50.81,40.62 50.81,-0.01 0.06,-0.01

Small or netless copper shapes (teardrops, artwork), in the pictures only: 465 on Top Layer, 84 on Bottom Layer, 30 on 信号层1, 23 on 信号层2

## Text on the board
Bottom Silkscreen Layer: GIN0➡..➡GIN10➡NC | GPIO18➡...➡GPIO45
